# EAGLE design hub (EAGLE 9.6.0)
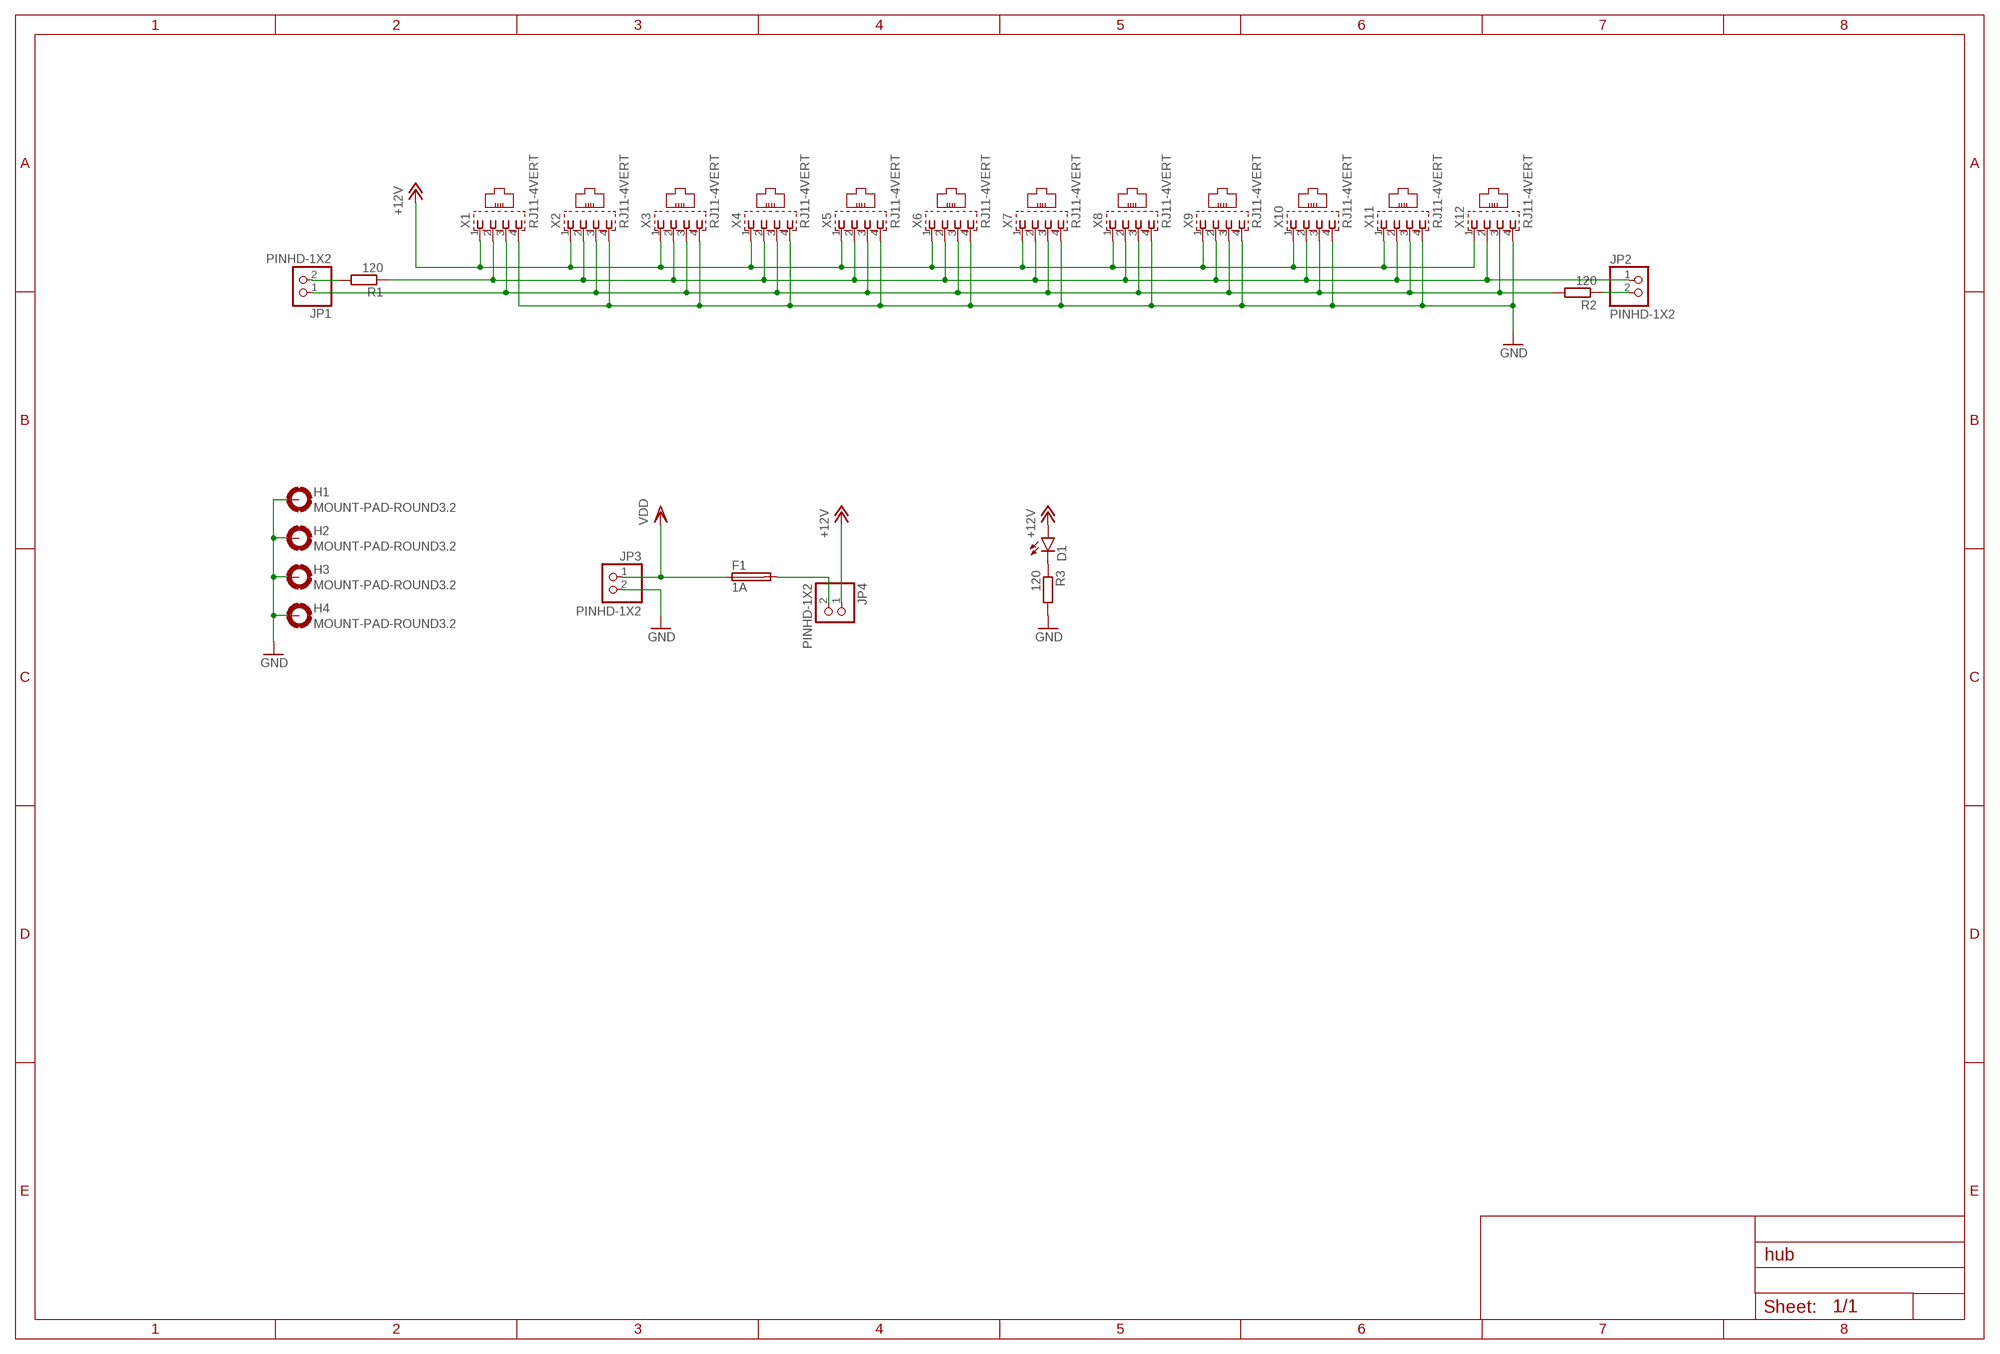
[diagram p0: schematic, sheet 1]

## Parts
D1  LED1206  [CHIPLED_1206]
F1  1A  5X20_FUSE  [5X20_FUSE]
H1  MOUNT-PAD-ROUND3.2  [3,2-PAD]
H2  MOUNT-PAD-ROUND3.2  [3,2-PAD]
H3  MOUNT-PAD-ROUND3.2  [3,2-PAD]
H4  MOUNT-PAD-ROUND3.2  [3,2-PAD]
JP1  PINHD-1X2  [1X02]
JP2  PINHD-1X2  [1X02]
JP3  PINHD-1X2  [1X02]
JP4  PINHD-1X2  [1X02]
R1  120  RESISTOR0805  [R0805]
R2  120  RESISTOR0805  [R0805]
R3  120  RESISTOR0805  [R0805]
X1  RJ11-4VERT  [RJ11-4_VERT]
X2  RJ11-4VERT  [RJ11-4_VERT]
X3  RJ11-4VERT  [RJ11-4_VERT]
X4  RJ11-4VERT  [RJ11-4_VERT]
X5  RJ11-4VERT  [RJ11-4_VERT]
X6  RJ11-4VERT  [RJ11-4_VERT]
X7  RJ11-4VERT  [RJ11-4_VERT]
X8  RJ11-4VERT  [RJ11-4_VERT]
X9  RJ11-4VERT  [RJ11-4_VERT]
X10  RJ11-4VERT  [RJ11-4_VERT]
X11  RJ11-4VERT  [RJ11-4_VERT]
X12  RJ11-4VERT  [RJ11-4_VERT]

## Nets
+12V: D1.A JP4.1 X1.1 X2.1 X3.1 X4.1 X5.1 X6.1 X7.1 X8.1 X9.1 X10.1 X11.1 X12.1
GND: H1.B3,2(MOUNT) H1.P$1(MOUNT) H1.P$2(MOUNT) H1.P$3(MOUNT) H1.P$4(MOUNT) H1.P$5(MOUNT) H1.P$6(MOUNT) H1.P$7(MOUNT) H1.P$8(MOUNT) H2.B3,2(MOUNT) H2.P$1(MOUNT) H2.P$2(MOUNT) H2.P$3(MOUNT) H2.P$4(MOUNT) H2.P$5(MOUNT) H2.P$6(MOUNT) H2.P$7(MOUNT) H2.P$8(MOUNT) H3.B3,2(MOUNT) H3.P$1(MOUNT) H3.P$2(MOUNT) H3.P$3(MOUNT) H3.P$4(MOUNT) H3.P$5(MOUNT) H3.P$6(MOUNT) H3.P$7(MOUNT) H3.P$8(MOUNT) H4.B3,2(MOUNT) H4.P$1(MOUNT) H4.P$2(MOUNT) H4.P$3(MOUNT) H4.P$4(MOUNT) H4.P$5(MOUNT) H4.P$6(MOUNT) H4.P$7(MOUNT) H4.P$8(MOUNT) JP3.2 R3.2 X1.4 X2.4 X3.4 X4.4 X5.4 X6.4 X7.4 X8.4 X9.4 X10.4 X11.4 X12.4
N$1: JP2.2 R2.1
N$2: JP2.1 R1.1 X1.2 X2.2 X3.2 X4.2 X5.2 X6.2 X7.2 X8.2 X9.2 X10.2 X11.2 X12.2
N$3: JP1.1 R2.2 X1.3 X2.3 X3.3 X4.3 X5.3 X6.3 X7.3 X8.3 X9.3 X10.3 X11.3 X12.3
N$4: JP1.2 R1.2
N$5: D1.C R3.1
N$6: F1.2A F1.2B JP4.2
VDD: F1.1A F1.1B JP3.1

## Library data of the parts
D1 = SMD:LED
F1 = THT:5X20_FUSE
H1-H4 = THT:MOUNT-PAD-ROUND: MOUNTING PAD, round
JP1-JP4 = THT:PINHD-1X2: PIN HEADER
R1-R3 = SMD:RESISTOR
X1-X12 = THT:RJ11-4

## Board
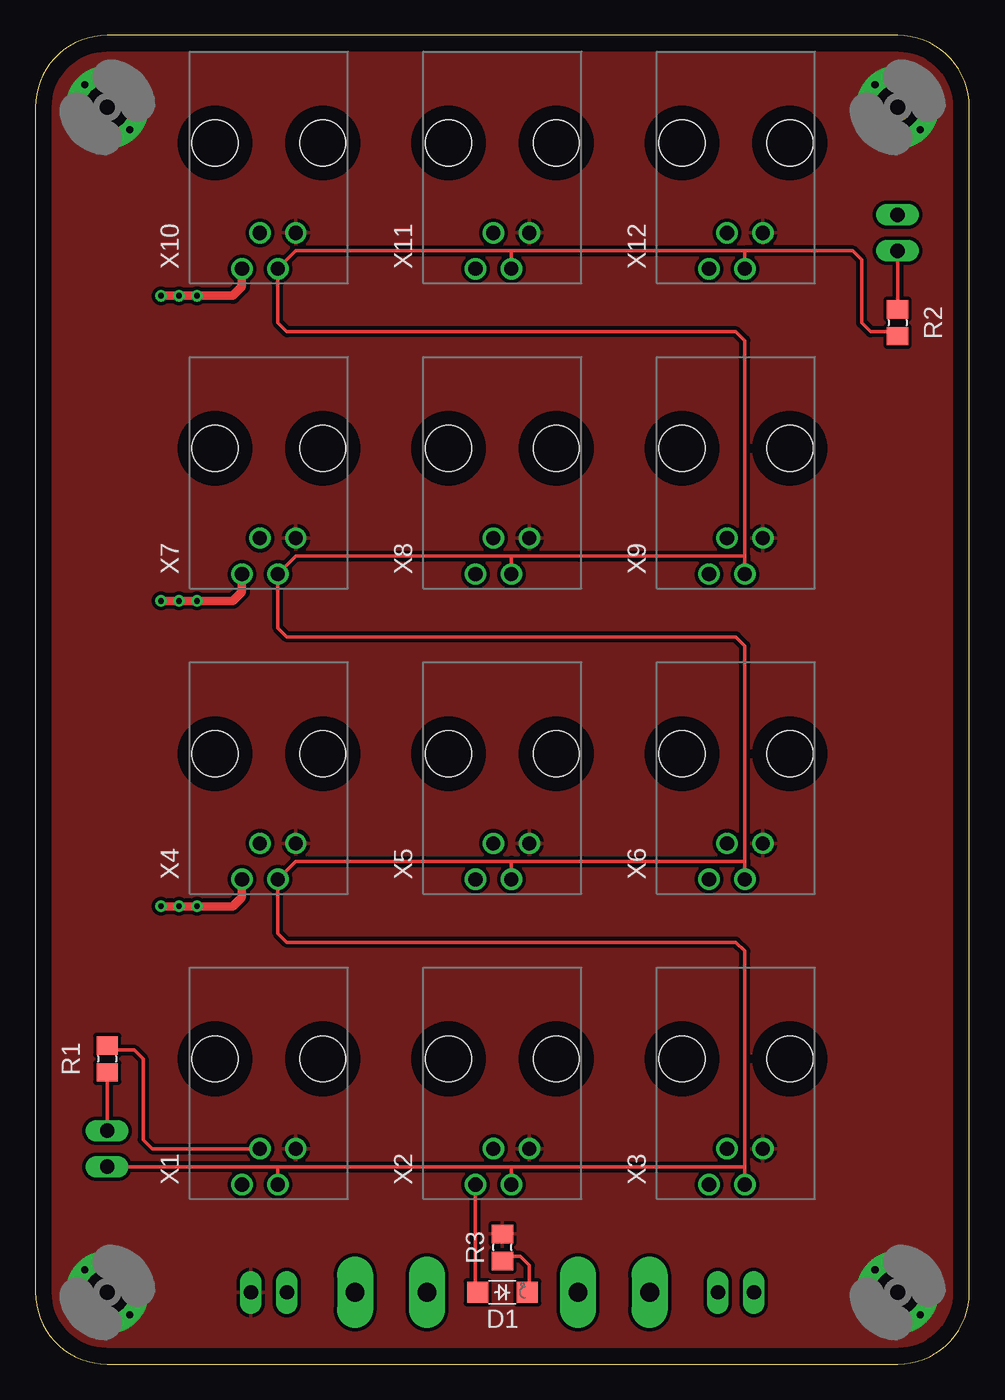
[diagram p1: board, top side]
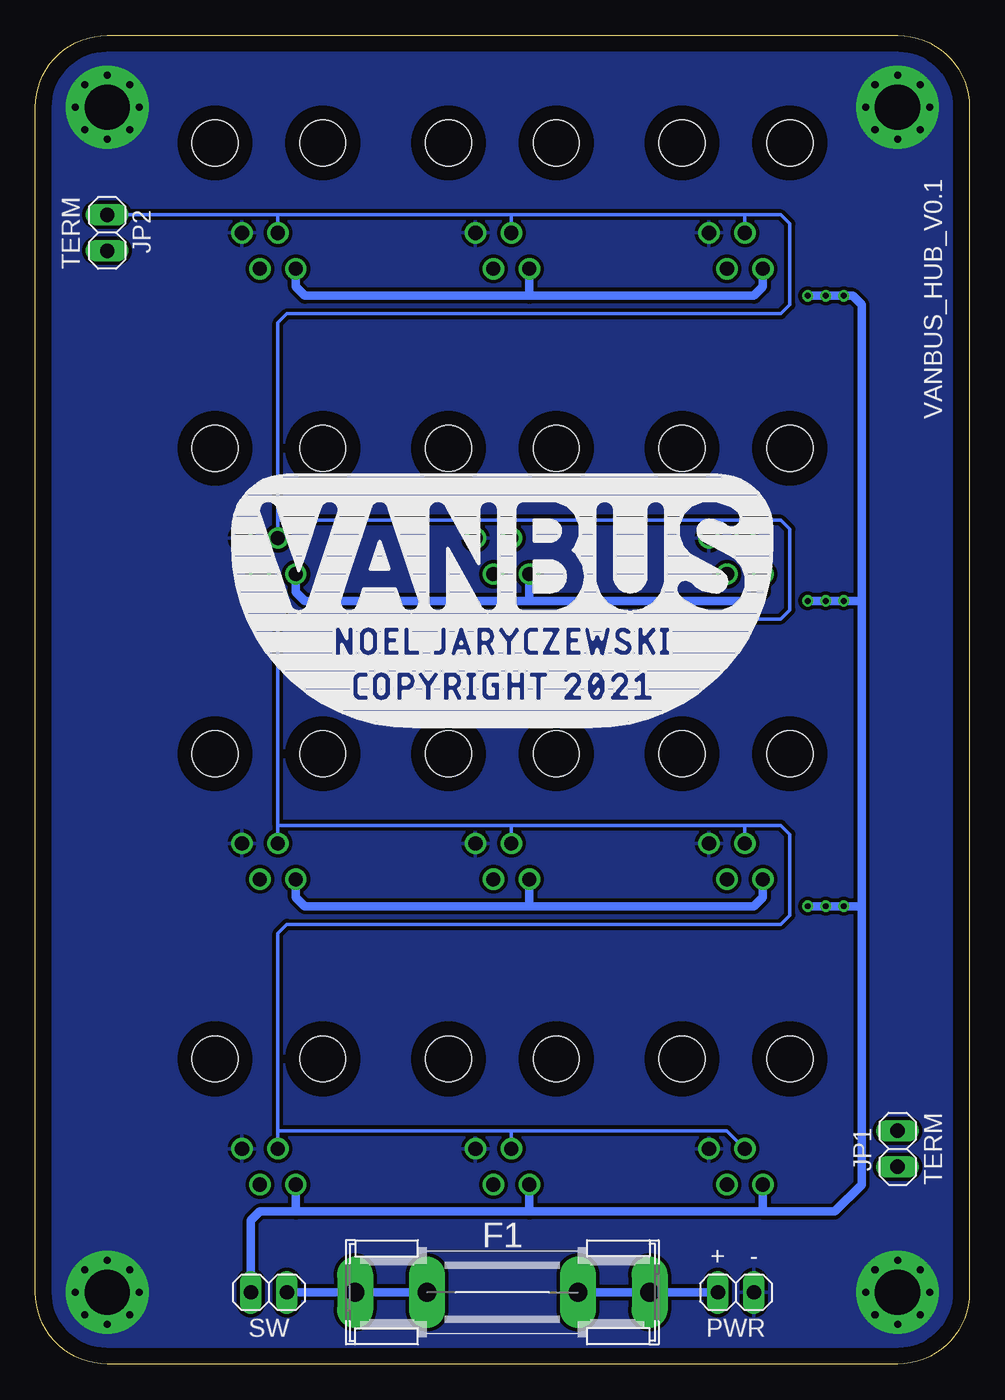
[diagram p2: board, bottom side, seen from below]

Size 66.04 x 93.98 mm. Coordinates in mm from the lower left corner, seen from the top.
Outline: 0,88.9 0,5.08 arc90 5.08,0 60.96,0 arc90 66.04,5.08 66.04,88.9 arc90 60.96,93.98 5.08,93.98 arc90 0,88.9
Copper layers (1*16): Top 0.035mm / dielectric 1.5mm / Bottom 0.035mm
Design rules "default *": minimum track width 6mil, minimum drill 0.35mm, track to track 8mil, track to pad 8mil, pad to pad 8mil, via to via 8mil, smd to smd 8mil, copper to edge 40mil, drill to drill 6mil, minimum pad ring 10mil, minimum via ring 8mil, stop-mask expansion 4mil, vias tented up to drill 16mil, thermal gap 10mil

### Footprints (pad centres in the part's own frame; a part is rotated, then mirrored left to right if it is on the bottom)
CHIPLED_1206 = smd 1.5 x 1.5: A 0,-1.75; C 0,1.75
5X20_FUSE = drill 1.321 pad 2.54 long: 1A -10.414,0; 1B -5.334,0; 2A 10.414,0; 2B 5.334,0
3,2-PAD = drill 3.2 pad 5.842: B3,2 0,0 | drill 0.5: P$1 0,2.261; P$2 0,-2.261; P$3 2.261,0; P$4 -2.261,0; P$5 -1.598,1.598; P$6 1.598,1.598; P$7 -1.598,-1.598; P$8 1.598,-1.598
1X02 = drill 1.016 long: 1 -1.27,0; 2 1.27,0
R0805 = smd 1.3 x 1.5: 1 -0.95,0; 2 0.95,0
RJ11-4_VERT = drill 1: 1 -1.905,-8.89; 2 -0.635,-6.35; 3 0.635,-8.89; 4 1.905,-6.35 | hole 3.25: -3.81,0; 3.81,0

### Placement (x,y rotation side)
D1  33.02,5.08 270 top
F1  33.02,5.08 180 bottom
H1  5.08,5.08 0 top
H2  60.96,5.08 0 top
H3  5.08,88.9 0 top
H4  60.96,88.9 0 top
JP1  5.08,15.24 90 bottom
JP2  60.96,80.01 270 bottom
JP3  16.51,5.08 0 bottom
JP4  49.53,5.08 0 bottom
R1  5.08,21.59 270 top
R2  60.96,73.66 270 top
R3  33.02,8.26 90 top
X1  16.51,21.59 0 top
X2  33.02,21.59 0 top
X3  49.53,21.59 0 top
X4  16.51,43.18 0 top
X5  33.02,43.18 0 top
X6  49.53,43.18 0 top
X7  16.51,64.77 0 top
X8  33.02,64.77 0 top
X9  49.53,64.77 0 top
X10  16.51,86.36 0 top
X11  33.02,86.36 0 top
X12  49.53,86.36 0 top

### Tracks (layer width: path | path; a pad name or v marks a point on that pad's centre or on a via)
+12V  (via drill 0.4)
  Top 0.254: D1.A 31.11,5.24 X2.1
  Top 0.61: X4.1 14.61,33.02 13.97,32.38 v11.43,32.38 v10.16,32.38 v8.89,32.38 | X7.1 14.61,54.61 13.97,53.98 v11.43,53.98 v10.16,53.98 v8.89,53.98 | X10.1 14.61,76.2 13.97,75.56 v11.43,75.56 v10.16,75.56 v8.89,75.56
  Bottom 0.61: X1.1 14.61,10.79 | 14.61,10.79 31.11,10.79 | 31.11,10.79 47.62,10.79 | 47.62,10.79 50.16,10.79 50.8,10.16 JP4.1 | X2.1 31.11,10.79 | X4.1 14.61,33.02 15.24,32.38 31.11,32.38 | 31.11,32.38 46.99,32.38 47.62,33.02 X6.1 | X5.1 31.11,32.38 | X7.1 14.61,54.61 15.24,53.98 31.11,53.98 | 31.11,53.98 46.99,53.98 47.62,54.61 X9.1 | X8.1 31.11,53.98 | X10.1 14.61,76.2 15.24,75.56 31.11,75.56 | 31.11,75.56 46.99,75.56 47.62,76.2 X12.1 | X11.1 31.11,75.56 | 14.61,10.79 9.53,10.79 7.62,12.7 7.62,32.38 | 7.62,32.38 7.62,53.98 | 7.62,53.98 7.62,74.93 8.26,75.56 v8.89,75.56 v10.16,75.56 v11.43,75.56 | 7.62,53.98 v11.43,53.98 | 7.62,32.38 v11.43,32.38 | X3.1 47.62,10.79
GND
  pour Top (isolate 0.254): 60.96,1.27 5.08,1.27 arc-90 1.27,5.08 1.27,88.9 arc-90 5.08,92.71 60.96,92.71 arc-90 64.77,88.9 64.77,5.08 arc-90
  pour Bottom (isolate 0.254): 60.96,1.27 5.08,1.27 arc-90 1.27,5.08 1.27,88.9 arc-90 5.08,92.71 60.96,92.71 arc-90 64.77,88.9 64.77,5.08 arc-90
N$1
  Top 0.254: JP2.2 R2.1
N$2
  Top 0.254: R1.1 5.4,22.54 5.71,22.23 6.99,22.23 7.62,21.59 7.62,15.88 8.26,15.24 X1.2
  Bottom 0.254: X10.2 15.88,81.28 | 15.88,81.28 32.38,81.28 | 32.38,81.28 48.9,81.28 | 48.9,81.28 X12.2 | X11.2 32.38,81.28 | X7.2 15.88,59.69 | 15.88,59.69 32.38,59.69 | X9.2 48.9,59.69 | X8.2 32.38,59.69 | X4.2 15.88,38.1 | 15.88,38.1 32.38,38.1 | 32.38,38.1 48.9,38.1 | 48.9,38.1 X6.2 | X5.2 32.38,38.1 | X1.2 17.14,16.51 32.38,16.51 | 32.38,16.51 48.9,16.51 | X3.2 48.9,16.51 | X2.2 32.38,16.51 | 48.9,81.28 JP2.1 | 32.38,59.69 48.9,59.69 | 48.9,59.69 48.9,73.66 48.26,74.3 13.34,74.3 12.7,74.93 12.7,80.64 13.34,81.28 15.88,81.28 | 48.9,38.1 48.9,52.07 48.26,52.7 13.34,52.7 12.7,53.34 12.7,59.05 13.34,59.69 15.88,59.69 | 48.9,16.51 48.9,30.48 48.26,31.11 13.34,31.11 12.7,31.75 12.7,37.47 13.34,38.1 15.88,38.1
N$3
  Top 0.254: 33.66,78.74 18.41,78.74 X10.3 17.14,73.66 17.78,73.03 49.53,73.03 50.16,72.39 X9.3 50.16,57.15 33.66,57.15 | 33.66,78.74 50.16,78.74 | X11.3 33.66,78.74 | 33.66,57.15 18.41,57.15 X7.3 17.14,52.07 17.78,51.44 49.53,51.44 50.16,50.8 X6.3 50.16,35.56 33.66,35.56 | X8.3 33.66,57.15 | 33.66,35.56 18.41,35.56 X4.3 17.14,30.48 17.78,29.84 49.53,29.84 50.16,29.21 X3.3 50.16,13.97 33.66,13.97 | X5.3 33.66,35.56 | X1.3 17.14,13.97 | 17.14,13.97 33.66,13.97 | X2.3 33.66,13.97 | 17.14,13.97 JP1.1 | R2.2 60.65,73.03 59.05,73.03 58.42,73.66 58.42,78.11 57.78,78.74 50.16,78.74 | 50.16,78.74 X12.3
N$4
  Top 0.254: R1.2 JP1.2
N$5
  Top 0.254: D1.C 34.77,5.56 34.92,5.71 34.92,6.99 34.29,7.62 33.34,7.62 R3.1
N$6
  Bottom 0.61: F1.2B F1.2A JP4.2
VDD
  Bottom 0.61: JP3.1 F1.1A F1.1B

### Text on the board
bPlace: VANBUS_HUB_V0.1 | TERM | TERM | - | + | PWR | SW